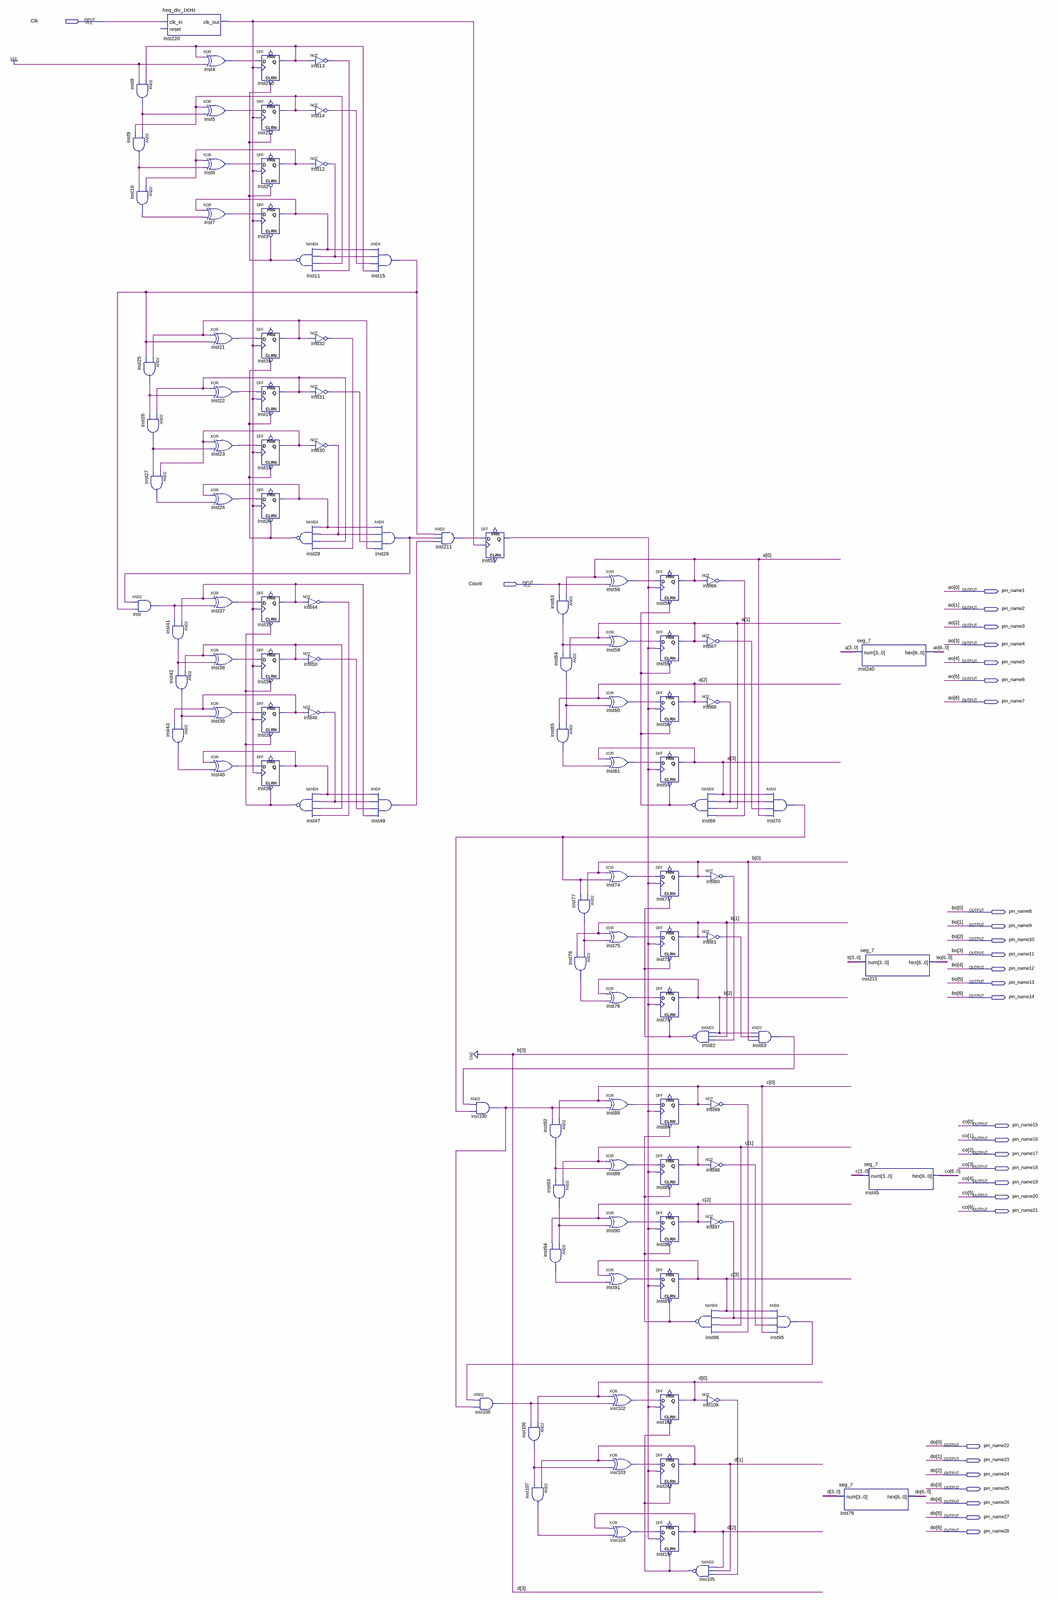
[diagram p0: schematic sheet, whole]
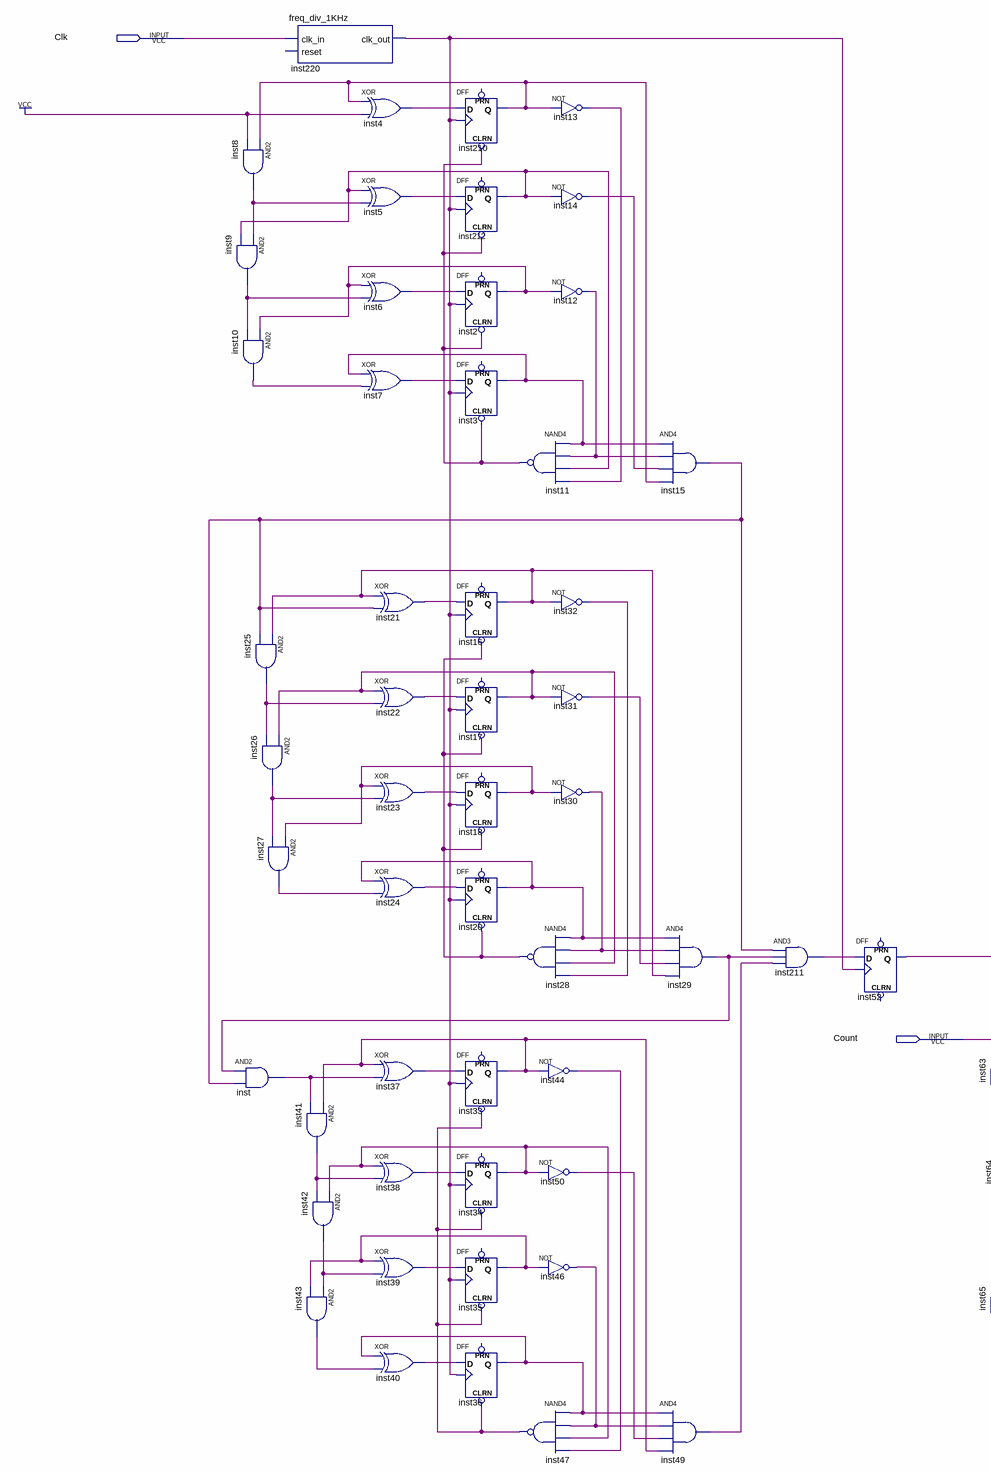
[diagram p1: schematic sheet, upper left part]
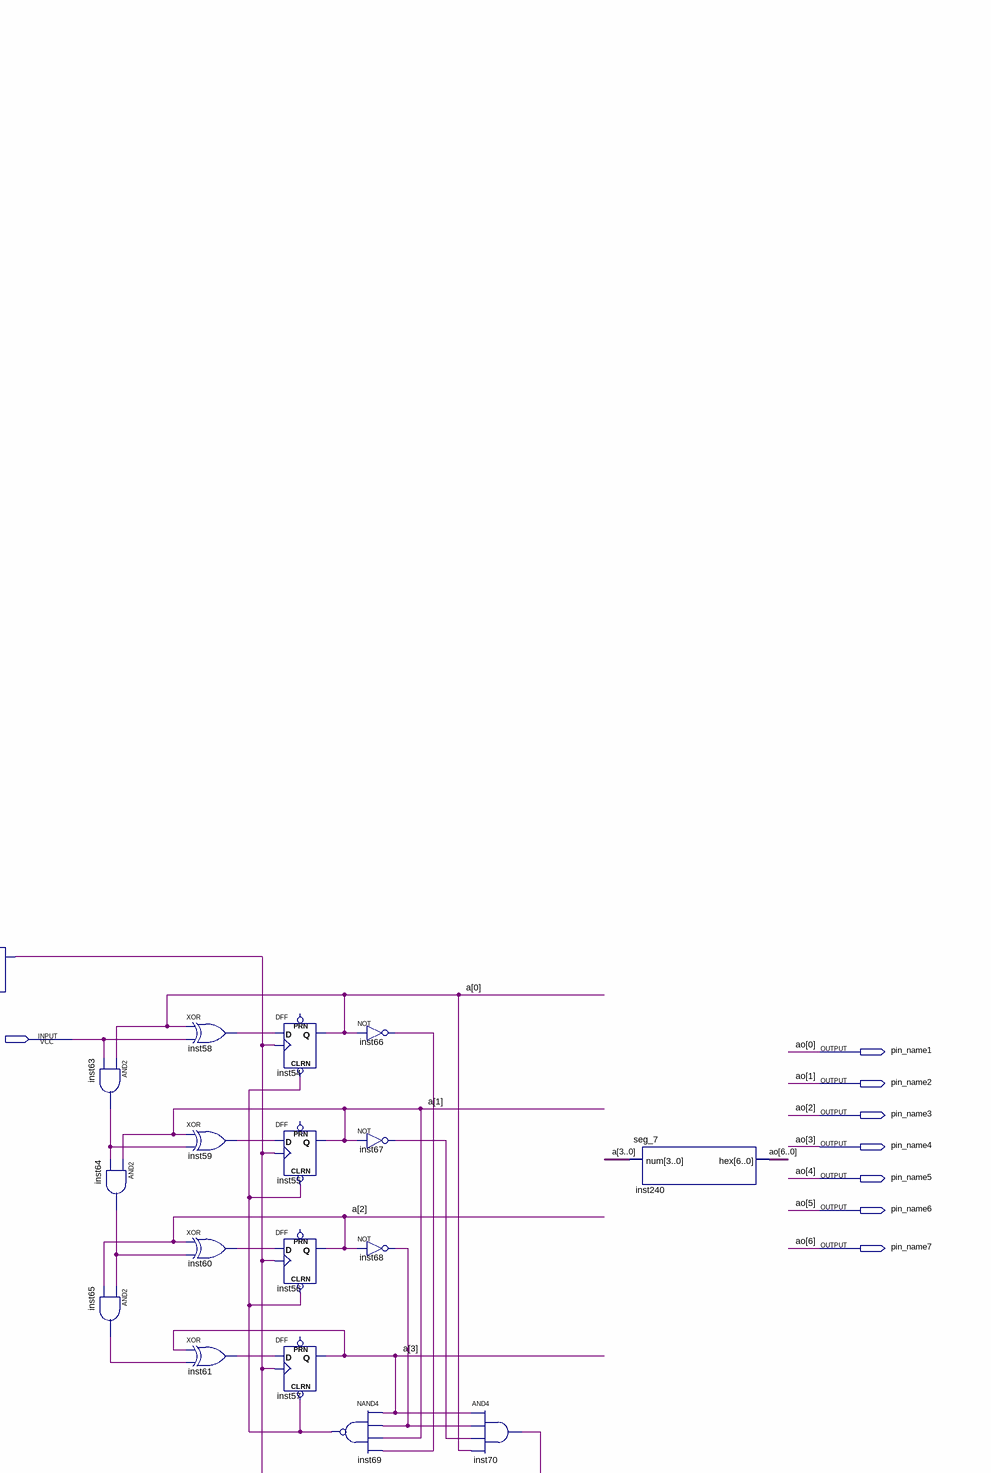
[diagram p2: schematic sheet, upper right part]
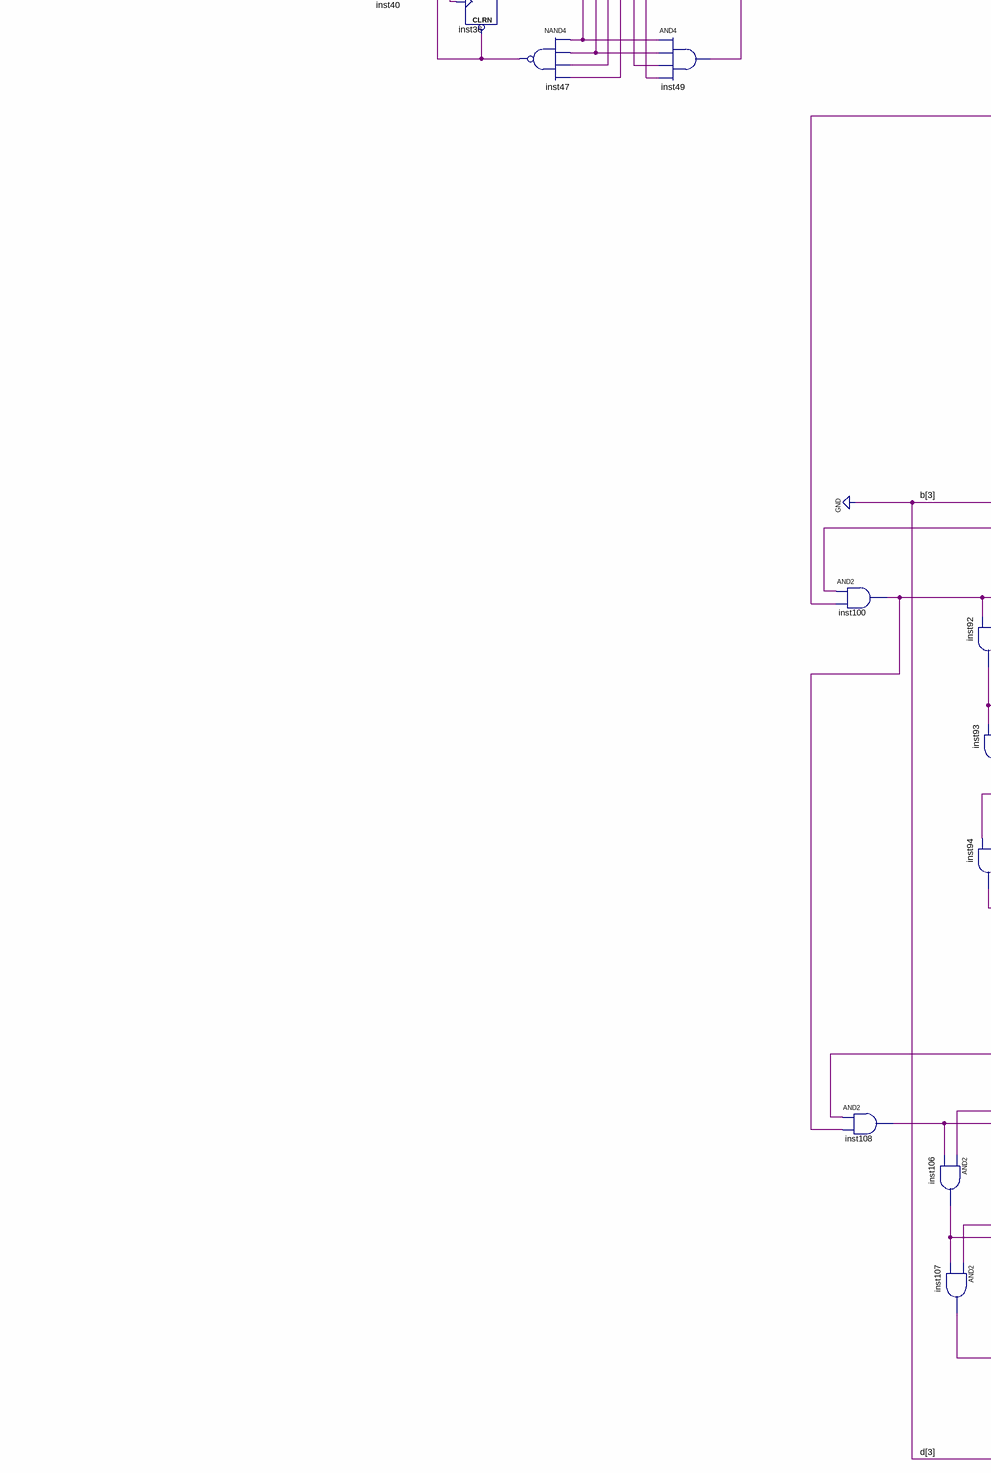
[diagram p3: schematic sheet, lower left part]
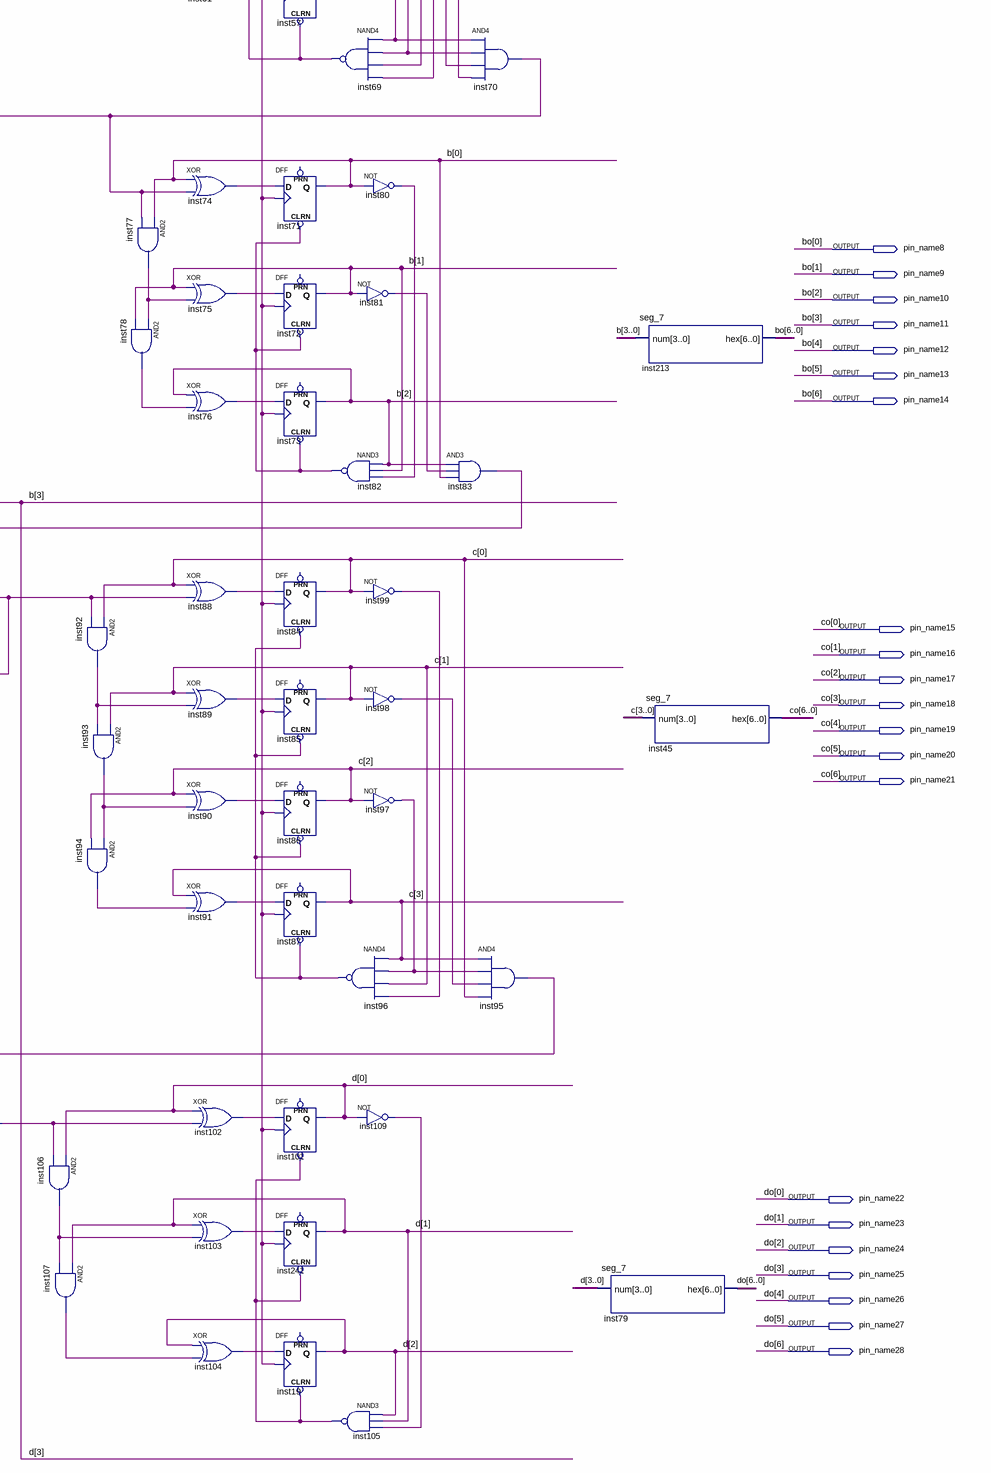
[diagram p4: schematic sheet, lower right part]
// Quartus schematic lab05.bdf as structural Verilog: 112 symbols, 30 pins
module lab05 (
  input  Clk,
  input  Count,
  output pin_name1,
  output pin_name2,
  output pin_name3,
  output pin_name4,
  output pin_name5,
  output pin_name6,
  output pin_name7,
  output pin_name8,
  output pin_name9,
  output pin_name10,
  output pin_name11,
  output pin_name12,
  output pin_name13,
  output pin_name14,
  output pin_name15,
  output pin_name16,
  output pin_name17,
  output pin_name18,
  output pin_name19,
  output pin_name20,
  output pin_name21,
  output pin_name22,
  output pin_name23,
  output pin_name24,
  output pin_name25,
  output pin_name26,
  output pin_name27,
  output pin_name28
);

  wire inst2_q, inst3_q, inst4_out, inst5_out, inst6_out, inst7_out, inst8_out, inst9_out, inst10_out,
       inst11_out, inst12_out, inst13_out, inst14_out, inst15_out, inst16_q, inst17_q, inst18_q, inst20_q,
       inst21_out, inst22_out, inst23_out, inst24_out, inst25_out, inst26_out, inst27_out, inst28_out,
       inst29_out, inst30_out, inst31_out, inst32_out, inst33_q, inst34_q, inst35_q, inst36_q, inst37_out,
       inst38_out, inst39_out, inst40_out, inst41_out, inst42_out, inst43_out, inst44_out, inst46_out,
       inst47_out, inst49_out, inst50_out, inst52_q, inst58_out, inst59_out, inst60_out, inst61_out,
       inst63_out, inst64_out, inst65_out, inst66_out, inst67_out, inst68_out, inst69_out, inst70_out,
       inst74_out, inst75_out, inst76_out, inst77_out, inst78_out, inst80_out, inst81_out, inst82_out,
       inst83_out, inst88_out, inst89_out, inst90_out, inst91_out, inst92_out, inst93_out, inst94_out,
       inst95_out, inst96_out, inst97_out, inst98_out, inst99_out, inst100_out, inst102_out, inst103_out,
       inst104_out, inst105_out, inst106_out, inst107_out, inst108_out, inst109_out, inst210_q, inst211_out,
       inst212_q, inst220_clk_out, inst_out;
  wire [2:0] b, d;
  wire [3:0] a, c;

  and inst9 (inst9_out, inst8_out, inst212_q);
  and inst8 (inst8_out, inst210_q, 1'b1);
  and inst10 (inst10_out, inst2_q, inst9_out);
  and inst25 (inst25_out, inst16_q, inst15_out);
  and inst26 (inst26_out, inst17_q, inst25_out);
  and inst27 (inst27_out, inst18_q, inst26_out);
  and inst (inst_out, inst29_out, inst15_out);
  freq_div_1KHz inst220 (.clk_in(Clk), .clk_out(inst220_clk_out));  // open: reset
  and inst41 (inst41_out, inst33_q, inst_out);
  and inst42 (inst42_out, inst34_q, inst41_out);
  and inst43 (inst43_out, inst42_out, inst35_q);
  xor inst4 (inst4_out, inst210_q, 1'b1);
  xor inst5 (inst5_out, inst212_q, inst8_out);
  xor inst6 (inst6_out, inst2_q, inst9_out);
  xor inst7 (inst7_out, inst3_q, inst10_out);
  xor inst21 (inst21_out, inst16_q, inst15_out);
  xor inst22 (inst22_out, inst17_q, inst25_out);
  xor inst23 (inst23_out, inst18_q, inst26_out);
  xor inst24 (inst24_out, inst20_q, inst27_out);
  xor inst37 (inst37_out, inst33_q, inst_out);
  xor inst38 (inst38_out, inst34_q, inst41_out);
  xor inst39 (inst39_out, inst35_q, inst42_out);
  xor inst40 (inst40_out, inst36_q, inst43_out);
  DFF inst210 (.CLRN(inst11_out), .CLK(inst220_clk_out), .D(inst4_out), .Q(inst210_q));  // open: PRN
  DFF inst212 (.CLRN(inst11_out), .CLK(inst220_clk_out), .D(inst5_out), .Q(inst212_q));  // open: PRN
  DFF inst2 (.CLRN(inst11_out), .CLK(inst220_clk_out), .D(inst6_out), .Q(inst2_q));  // open: PRN
  DFF inst3 (.CLRN(inst11_out), .CLK(inst220_clk_out), .D(inst7_out), .Q(inst3_q));  // open: PRN
  DFF inst16 (.CLRN(inst28_out), .CLK(inst220_clk_out), .D(inst21_out), .Q(inst16_q));  // open: PRN
  DFF inst17 (.CLRN(inst28_out), .CLK(inst220_clk_out), .D(inst22_out), .Q(inst17_q));  // open: PRN
  DFF inst18 (.CLRN(inst28_out), .CLK(inst220_clk_out), .D(inst23_out), .Q(inst18_q));  // open: PRN
  DFF inst20 (.CLRN(inst28_out), .CLK(inst220_clk_out), .D(inst24_out), .Q(inst20_q));  // open: PRN
  DFF inst33 (.CLRN(inst47_out), .CLK(inst220_clk_out), .D(inst37_out), .Q(inst33_q));  // open: PRN
  DFF inst34 (.CLRN(inst47_out), .CLK(inst220_clk_out), .D(inst38_out), .Q(inst34_q));  // open: PRN
  DFF inst35 (.CLRN(inst47_out), .CLK(inst220_clk_out), .D(inst39_out), .Q(inst35_q));  // open: PRN
  DFF inst36 (.CLRN(inst47_out), .CLK(inst220_clk_out), .D(inst40_out), .Q(inst36_q));  // open: PRN
  nand inst11 (inst11_out, inst3_q, inst12_out, inst212_q, inst13_out);
  nand inst28 (inst28_out, inst20_q, inst30_out, inst17_q, inst32_out);
  nand inst47 (inst47_out, inst36_q, inst46_out, inst34_q, inst44_out);
  not inst13 (inst13_out, inst210_q);
  not inst14 (inst14_out, inst212_q);
  not inst12 (inst12_out, inst2_q);
  not inst32 (inst32_out, inst16_q);
  not inst31 (inst31_out, inst17_q);
  not inst30 (inst30_out, inst18_q);
  not inst44 (inst44_out, inst33_q);
  not inst50 (inst50_out, inst34_q);
  not inst46 (inst46_out, inst35_q);
  and inst15 (inst15_out, inst3_q, inst12_out, inst14_out, inst210_q);
  and inst29 (inst29_out, inst20_q, inst30_out, inst31_out, inst16_q);
  and inst49 (inst49_out, inst36_q, inst46_out, inst50_out, inst33_q);
  and inst211 (inst211_out, inst15_out, inst29_out, inst49_out);
  and inst100 (inst100_out, inst83_out, inst70_out);
  DFF inst52 (.CLK(inst220_clk_out), .D(inst211_out), .Q(inst52_q));  // open: CLRN, PRN
  and inst108 (inst108_out, inst95_out, inst100_out);
  and inst106 (inst106_out, d[0], inst108_out);
  and inst107 (inst107_out, d[1], inst106_out);
  and inst63 (inst63_out, a[0], Count);
  and inst64 (inst64_out, a[1], inst63_out);
  and inst65 (inst65_out, inst64_out, a[2]);
  and inst92 (inst92_out, c[0], inst100_out);
  and inst93 (inst93_out, c[1], inst92_out);
  and inst94 (inst94_out, inst93_out, c[2]);
  and inst77 (inst77_out, b[0], inst70_out);
  and inst78 (inst78_out, inst77_out, b[1]);
  xor inst58 (inst58_out, a[0], Count);
  xor inst59 (inst59_out, a[1], inst63_out);
  xor inst60 (inst60_out, a[2], inst64_out);
  xor inst61 (inst61_out, a[3], inst65_out);
  xor inst74 (inst74_out, b[0], inst70_out);
  xor inst75 (inst75_out, b[1], inst77_out);
  xor inst76 (inst76_out, b[2], inst78_out);
  xor inst88 (inst88_out, c[0], inst100_out);
  xor inst89 (inst89_out, c[1], inst92_out);
  xor inst90 (inst90_out, c[2], inst93_out);
  xor inst91 (inst91_out, c[3], inst94_out);
  xor inst102 (inst102_out, d[0], inst108_out);
  xor inst103 (inst103_out, d[1], inst106_out);
  xor inst104 (inst104_out, d[2], inst107_out);
  DFF inst54 (.CLRN(inst69_out), .CLK(inst52_q), .D(inst58_out), .Q(a[0]));  // open: PRN
  DFF inst55 (.CLRN(inst69_out), .CLK(inst52_q), .D(inst59_out), .Q(a[1]));  // open: PRN
  DFF inst56 (.CLRN(inst69_out), .CLK(inst52_q), .D(inst60_out), .Q(a[2]));  // open: PRN
  DFF inst57 (.CLRN(inst69_out), .CLK(inst52_q), .D(inst61_out), .Q(a[3]));  // open: PRN
  DFF inst71 (.CLRN(inst82_out), .CLK(inst52_q), .D(inst74_out), .Q(b[0]));  // open: PRN
  DFF inst72 (.CLRN(inst82_out), .CLK(inst52_q), .D(inst75_out), .Q(b[1]));  // open: PRN
  DFF inst73 (.CLRN(inst82_out), .CLK(inst52_q), .D(inst76_out), .Q(b[2]));  // open: PRN
  DFF inst84 (.CLRN(inst96_out), .CLK(inst52_q), .D(inst88_out), .Q(c[0]));  // open: PRN
  DFF inst85 (.CLRN(inst96_out), .CLK(inst52_q), .D(inst89_out), .Q(c[1]));  // open: PRN
  DFF inst86 (.CLRN(inst96_out), .CLK(inst52_q), .D(inst90_out), .Q(c[2]));  // open: PRN
  DFF inst87 (.CLRN(inst96_out), .CLK(inst52_q), .D(inst91_out), .Q(c[3]));  // open: PRN
  DFF inst101 (.CLRN(inst105_out), .CLK(inst52_q), .D(inst102_out), .Q(d[0]));  // open: PRN
  DFF inst241 (.CLRN(inst105_out), .CLK(inst52_q), .D(inst103_out), .Q(d[1]));  // open: PRN
  DFF inst19 (.CLRN(inst105_out), .CLK(inst52_q), .D(inst104_out), .Q(d[2]));  // open: PRN
  nand inst69 (inst69_out, a[3], inst68_out, a[1], inst66_out);
  nand inst82 (inst82_out, b[2], b[1], inst80_out);
  nand inst96 (inst96_out, c[3], inst97_out, c[1], inst99_out);
  nand inst105 (inst105_out, d[2], d[1], inst109_out);
  not inst66 (inst66_out, a[0]);
  not inst67 (inst67_out, a[1]);
  not inst68 (inst68_out, a[2]);
  not inst80 (inst80_out, b[0]);
  not inst81 (inst81_out, b[1]);
  not inst99 (inst99_out, c[0]);
  not inst98 (inst98_out, c[1]);
  not inst97 (inst97_out, c[2]);
  not inst109 (inst109_out, d[0]);
  and inst83 (inst83_out, b[2], inst81_out, b[0]);
  and inst70 (inst70_out, a[3], inst68_out, inst67_out, a[0]);
  and inst95 (inst95_out, c[3], inst97_out, inst98_out, c[0]);
  seg_7 inst79 (
    .num({1'b0, d}),
    .hex({pin_name28, pin_name27, pin_name26, pin_name25, pin_name24, pin_name23, pin_name22}));
  seg_7 inst240 (.num(a), .hex({pin_name7, pin_name6, pin_name5, pin_name4, pin_name3, pin_name2, pin_name1}));
  seg_7 inst213 (
    .num({1'b0, b}), .hex({pin_name14, pin_name13, pin_name12, pin_name11, pin_name10, pin_name9, pin_name8}));
  seg_7 inst45 (.num(c), .hex({pin_name21, pin_name20, pin_name19, pin_name18, pin_name17, pin_name16, pin_name15}));

  // Other names for the same wires on the sheet: ao[6:0] = {pin_name7, pin_name6, pin_name5, pin_name4, pin_name3, pin_name2, pin_name1};
  //   bo[6:0] = {pin_name14, pin_name13, pin_name12, pin_name11, pin_name10, pin_name9, pin_name8};
  //   co[6:0] = {pin_name21, pin_name20, pin_name19, pin_name18, pin_name17, pin_name16, pin_name15};
  //   do[6:0] = {pin_name28, pin_name27, pin_name26, pin_name25, pin_name24, pin_name23, pin_name22}
endmodule
